# Altium schematic sheet Main.SchDoc
size A4
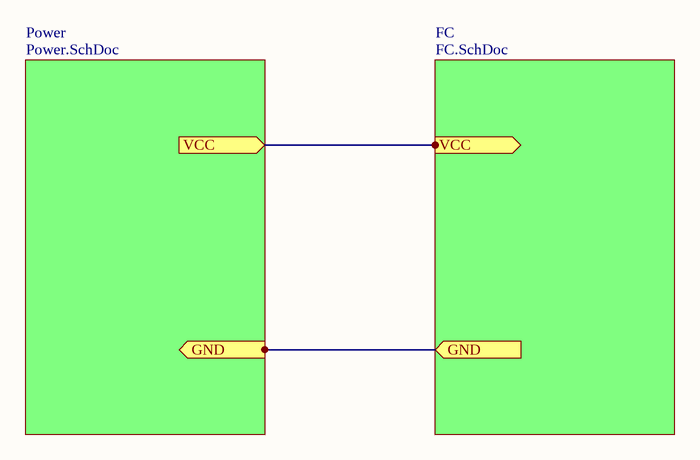
[diagram p0: Main.SchDoc]

## Sub-sheets
FC = FC.SchDoc: Port
Power = Power.SchDoc: Port

## Ports
GND, VCC

## Nets
GND: port GND, sheet Power/Port
VCC: port VCC, sheet FC/Port